# EAGLE design Battery Monitor (EAGLE 7.7.0)
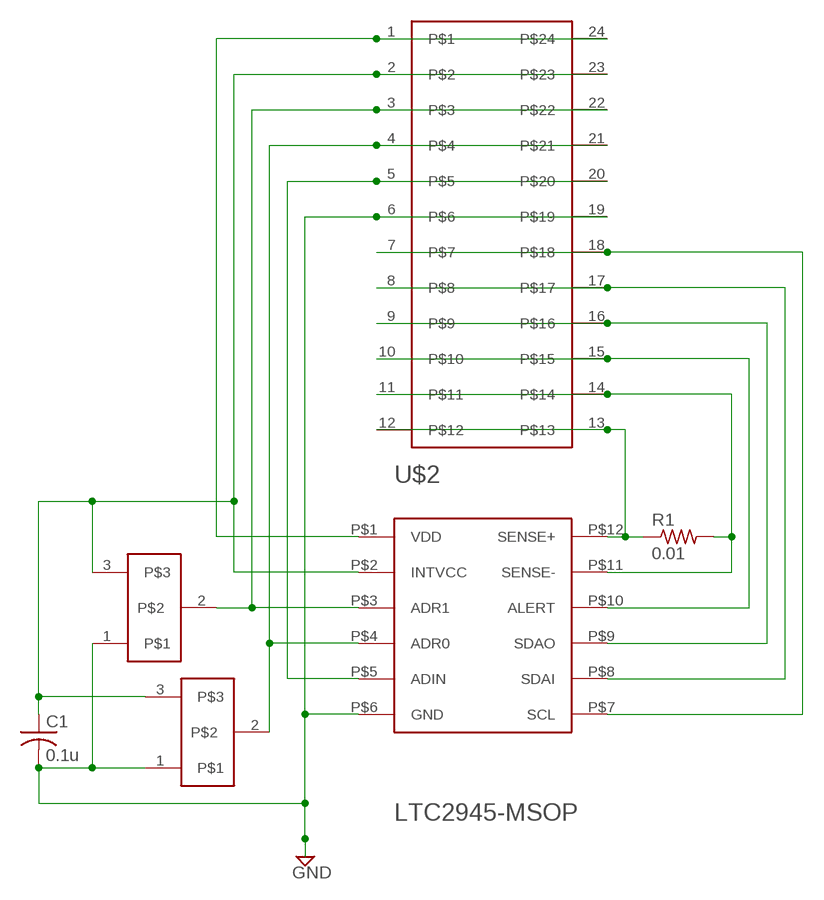
[diagram p0: schematic, sheet 1]

## Parts
C1  0.1u  C-USC1812  [C1812]
R1  0.01  R-US_R2010  [R2010]
U$2  LTC2945-MSOP  [MSOP12]
U$3  24-PINEVAL  [DIL24-6]
U$4  JUMP-3  [JUMP-3]
U$5  JUMP-3  [JUMP-3]

## Nets
GND: C1.2 U$2.P$6(GND) U$3.6 U$3.19 U$4.1 U$5.1
N$2: C1.1 U$2.P$2(INTVCC) U$3.2 U$3.23 U$4.3 U$5.3
N$3: U$2.P$1(VDD) U$3.1 U$3.24
N$4: U$2.P$3(ADR1) U$3.3 U$3.22 U$4.2
N$5: U$2.P$4(ADR0) U$3.4 U$3.21 U$5.2
N$6: U$2.P$5(ADIN) U$3.5 U$3.20
N$7: U$2.P$7(SCL) U$3.7 U$3.18
N$8: U$2.P$9(SDAO) U$3.9 U$3.16
N$9: R1.1 U$2.P$12(SENSE+) U$3.12 U$3.13
N$10: U$2.P$10(ALERT) U$3.10 U$3.15
N$11: R1.2 U$2.P$11(SENSE-) U$3.11 U$3.14
N$14: U$2.P$8(SDAI) U$3.8 U$3.17

## Library data of the parts
C1 = resistor:C-US: CAPACITOR, American symbol
R1 = resistor:R-US_: RESISTOR, American symbol
U$2 = Raj:LTC2945-MSOP
U$3 = Raj:24-PINEVAL
U$4 U$5 = Raj:JUMP-3

## Net classes
0 default: clearance 0.205 mm

## Board
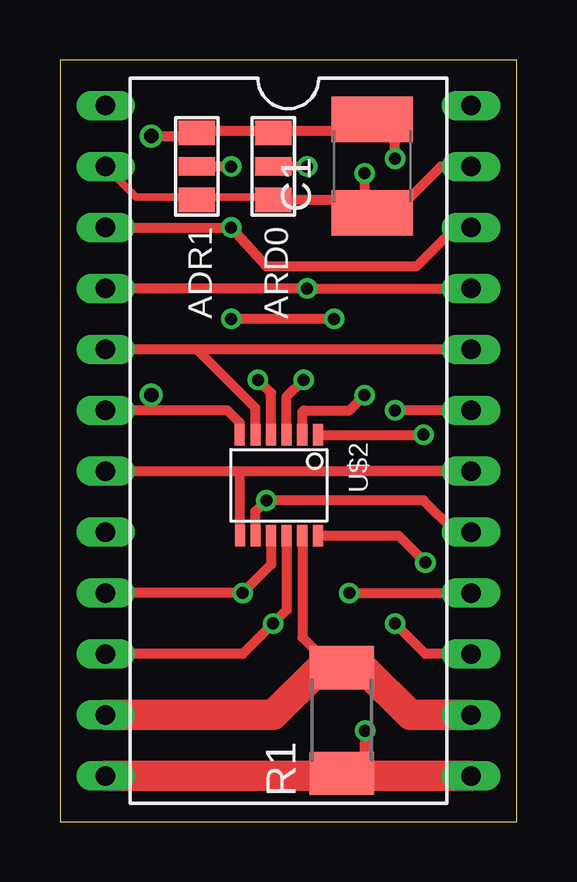
[diagram p1: board, top side]
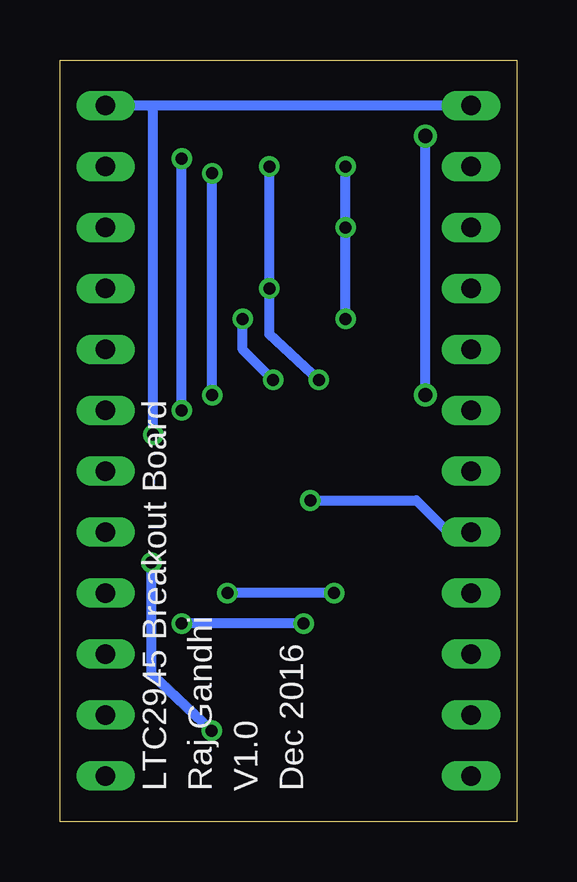
[diagram p2: board, bottom side, seen from below]

Size 19.05 x 31.75 mm. Coordinates in mm from the lower left corner, seen from the top.
Outline: 0,31.74 19.05,31.74 19.05,0 0,0 0,31.74
Outline: 0,31.75 0,31.74
Copper layers (1*16): Top 0.0356mm / dielectric 1.5011mm / Bottom 0.0356mm
Design rules "Battery Monitor": minimum track width 6mil, minimum drill 13mil, track to track 0.205mm, track to pad 0.205mm, pad to pad 0.205mm, via to via 0.205mm, smd to smd 6mil, copper to edge 15mil, drill to drill 6mil, minimum pad ring 7mil, minimum via ring 7mil, stop-mask expansion 2.5mil, vias tented up to drill 0mil, thermal gap 10mil

### Footprints (pad centres in the part's own frame; a part is rotated, then mirrored left to right if it is on the bottom)
C1812 = smd 1.9 x 3.4: 1 -1.95,0; 2 1.95,0
R2010 = smd 1.8 x 2.7: 1 -2.2,0; 2 2.2,0
MSOP12 = smd 0.42 x 0.9: P$1 0.37,-0.6; P$2 1.02,-0.6; P$3 1.67,-0.6; P$4 2.32,-0.6; P$5 2.973,-0.6; P$6 3.627,-0.6; P$7 3.623,3.6; P$8 2.973,3.6; P$9 2.32,3.6; P$10 1.67,3.6; P$11 1.02,3.6; P$12 0.37,3.6
DIL24-6 = drill 0.813 long: 1 -13.97,-7.62; 2 -11.43,-7.62; 3 -8.89,-7.62; 4 -6.35,-7.62; 5 -3.81,-7.62; 6 -1.27,-7.62; 7 1.27,-7.62; 8 3.81,-7.62; 9 6.35,-7.62; 10 8.89,-7.62; 11 11.43,-7.62; 12 13.97,-7.62; 13 13.97,7.62; 14 11.43,7.62; 15 8.89,7.62; 16 6.35,7.62; 17 3.81,7.62; 18 1.27,7.62; 19 -1.27,7.62; 20 -3.81,7.62; 21 -6.35,7.62; 22 -8.89,7.62; 23 -11.43,7.62; 24 -13.97,7.62
JUMP-3 = smd 1.016 x 1.524: 1 -1.397,0; 3 1.397,0 | smd 0.762 x 1.524: 2 0,0

### Placement (x,y rotation side)
C1  13.02,27.32 90 top
R1  11.75,4.22 90 top
U$2  11.13,15.52 180 top
U$3  9.52,15.88 270 top
U$4  5.71,27.32 270 top
U$5  8.89,27.32 270 top

### Tracks (layer width: path | path; a pad name or v marks a point on that pad's centre or on a via)
GND  (via drill 0.5, 0.6)
  Top 0.152: 12.42,28.78 12.88,29.23 C1.2 | 8.91,28.78 U$5.1 | 1.9,17.04 U$3.6
  Top 0.406: 12.42,28.78 8.89,28.78 | 8.89,28.78 U$5.1 | 8.89,28.78 5.71,28.78 U$4.1 5.57,28.58 v3.81,28.58 | U$3.19 v13.97,17.15 | v13.97,27.63 13.97,28.31 C1.2 | U$2.P$6 7.5,16.63 6.98,17.15 3.81,17.15 | 3.81,17.15 U$3.6 | 3.81,17.15 v3.81,17.78
  Bottom 0.406: v13.97,17.15 v13.97,27.63 | v3.81,17.78 v3.81,28.58
N$2  (via drill 0.5)
  Top 0.305: 5.71,26.03 8.25,26.03 U$5.3 | 5.71,26.03 3.17,26.03 U$3.2 | 5.71,26.03 U$4.3
  Top 0.406: C1.1 13.94,25.37 15.88,27.3 U$3.23 | U$5.3 12.46,25.92 C1.1 | U$2.P$2 10.1,17.09 10.16,17.15 12.06,17.15 v12.7,17.78 | v12.7,27.03 12.7,25.05 C1.1
  Bottom 0.406: v12.7,17.78 v12.7,27.03
N$3  (via drill 0.5)
  Top 0.406: U$2.P$1 15.15,16.12 v15.16,16.13
  Bottom 0.406: U$3.1 15.24,29.84 | 15.24,29.84 U$3.24 | v15.16,16.13 15.16,29.77 15.24,29.84
N$4  (via drill 0.5)
  Top 0.406: U$2.P$3 9.45,17.71 v10.16,18.41 | v11.43,20.95 v7.14,20.95 | v7.14,27.3 5.73,27.3 U$4.2 | U$3.3 v7.14,24.77 8.61,23.14 14.86,23.14 16.48,24.77 U$3.22
  Bottom 0.406: v10.16,18.41 11.43,19.69 v11.43,20.95 | v7.14,27.3 v7.14,24.77 v7.14,20.95
N$5  (via drill 0.5)
  Top 0.406: U$2.P$4 8.8,17.87 v8.25,18.41 | v10.31,27.3 U$5.2 | U$3.21 v10.31,22.23 U$3.4
  Bottom 0.406: v8.25,18.41 10.31,20.32 v10.31,22.23 v10.31,27.3
N$6
  Top 0.152: 17.14,19.79 U$3.20
  Top 0.406: U$2.P$5 8.15,17.25 5.71,19.69 | 5.71,19.69 U$3.5 | U$3.20 5.71,19.69
N$7
  Top 0.406: 11.96,14.61 U$3.18 7.62,14.61 | U$3.7 7.62,14.61 | U$2.P$7 7.5,14.49 7.62,14.61
N$8  (via drill 0.5)
  Top 0.406: U$2.P$9 8.8,10.71 v7.62,9.52 U$3.9 | v12.06,9.52 U$3.16
  Bottom 0.406: v7.62,9.52 v12.06,9.52
N$9  (via drill 0.5)
  Top 0.152: 1.9,1.96 U$3.12 | 17.14,1.8 U$3.13
  Top 0.406: 11.64,1.91 R1.1 | v12.72,3.79 12.67,1.91 | U$2.P$12 14.12,11.92 v15.24,10.8
  Top 1.27: U$3.12 11.64,1.91 | U$3.13 12.67,1.91 11.86,1.91 R1.1
  Bottom 0.406: v15.24,10.8 15.24,6.15 v12.72,3.79
N$10  (via drill 0.5)
  Top 0.406: U$2.P$10 9.45,8.82 v8.89,8.25 7.62,6.98 U$3.10 | U$3.15 15.24,6.98 v13.97,8.25
  Bottom 0.406: v8.89,8.25 v13.97,8.25
N$11
  Top 0.152: 17.14,4.39 U$3.14
  Top 0.406: U$2.P$11 10.1,7.68 10.79,6.98 10.79,6.35 | R1.2 12,6.42 12.06,6.35
  Top 1.27: U$3.11 8.89,4.45 10.79,6.35 12.06,6.35 12.7,6.35 14.6,4.45 U$3.14
N$14  (via drill 0.5)
  Top 0.406: U$2.P$8 8.15,12.93 v8.61,13.39 15.16,13.39 16.48,12.07 U$3.17
  Bottom 0.406: v8.61,13.39 4.19,13.39 2.82,12.01 1.96,12.01 U$3.8

### Text on the board
tNames: ADR1 | ARD0
bNames: Dec 2016 | V1.0 | Raj Gandhi | LTC2945 Breakout Board